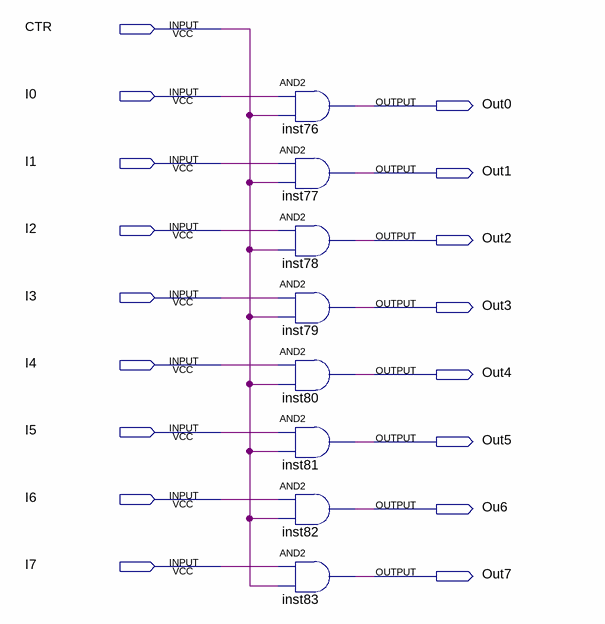
[diagram p0: schematic sheet]
// Quartus schematic Enable8.bdf as structural Verilog: 8 symbols, 17 pins
module Enable8 (
  input  CTR,
  input  I0,
  input  I1,
  input  I2,
  input  I3,
  input  I4,
  input  I5,
  input  I6,
  input  I7,
  output Out0,
  output Out1,
  output Out2,
  output Out3,
  output Out4,
  output Out5,
  output Ou6,
  output Out7
);

  and inst76 (Out0, I0, CTR);
  and inst77 (Out1, I1, CTR);
  and inst78 (Out2, I2, CTR);
  and inst79 (Out3, I3, CTR);
  and inst80 (Out4, I4, CTR);
  and inst81 (Out5, I5, CTR);
  and inst82 (Ou6, I6, CTR);
  and inst83 (Out7, I7, CTR);
endmodule
